# Altium schematic sheet Sheet1.SchDoc
size A3; SheetNumber: 1; SheetTotal: 1
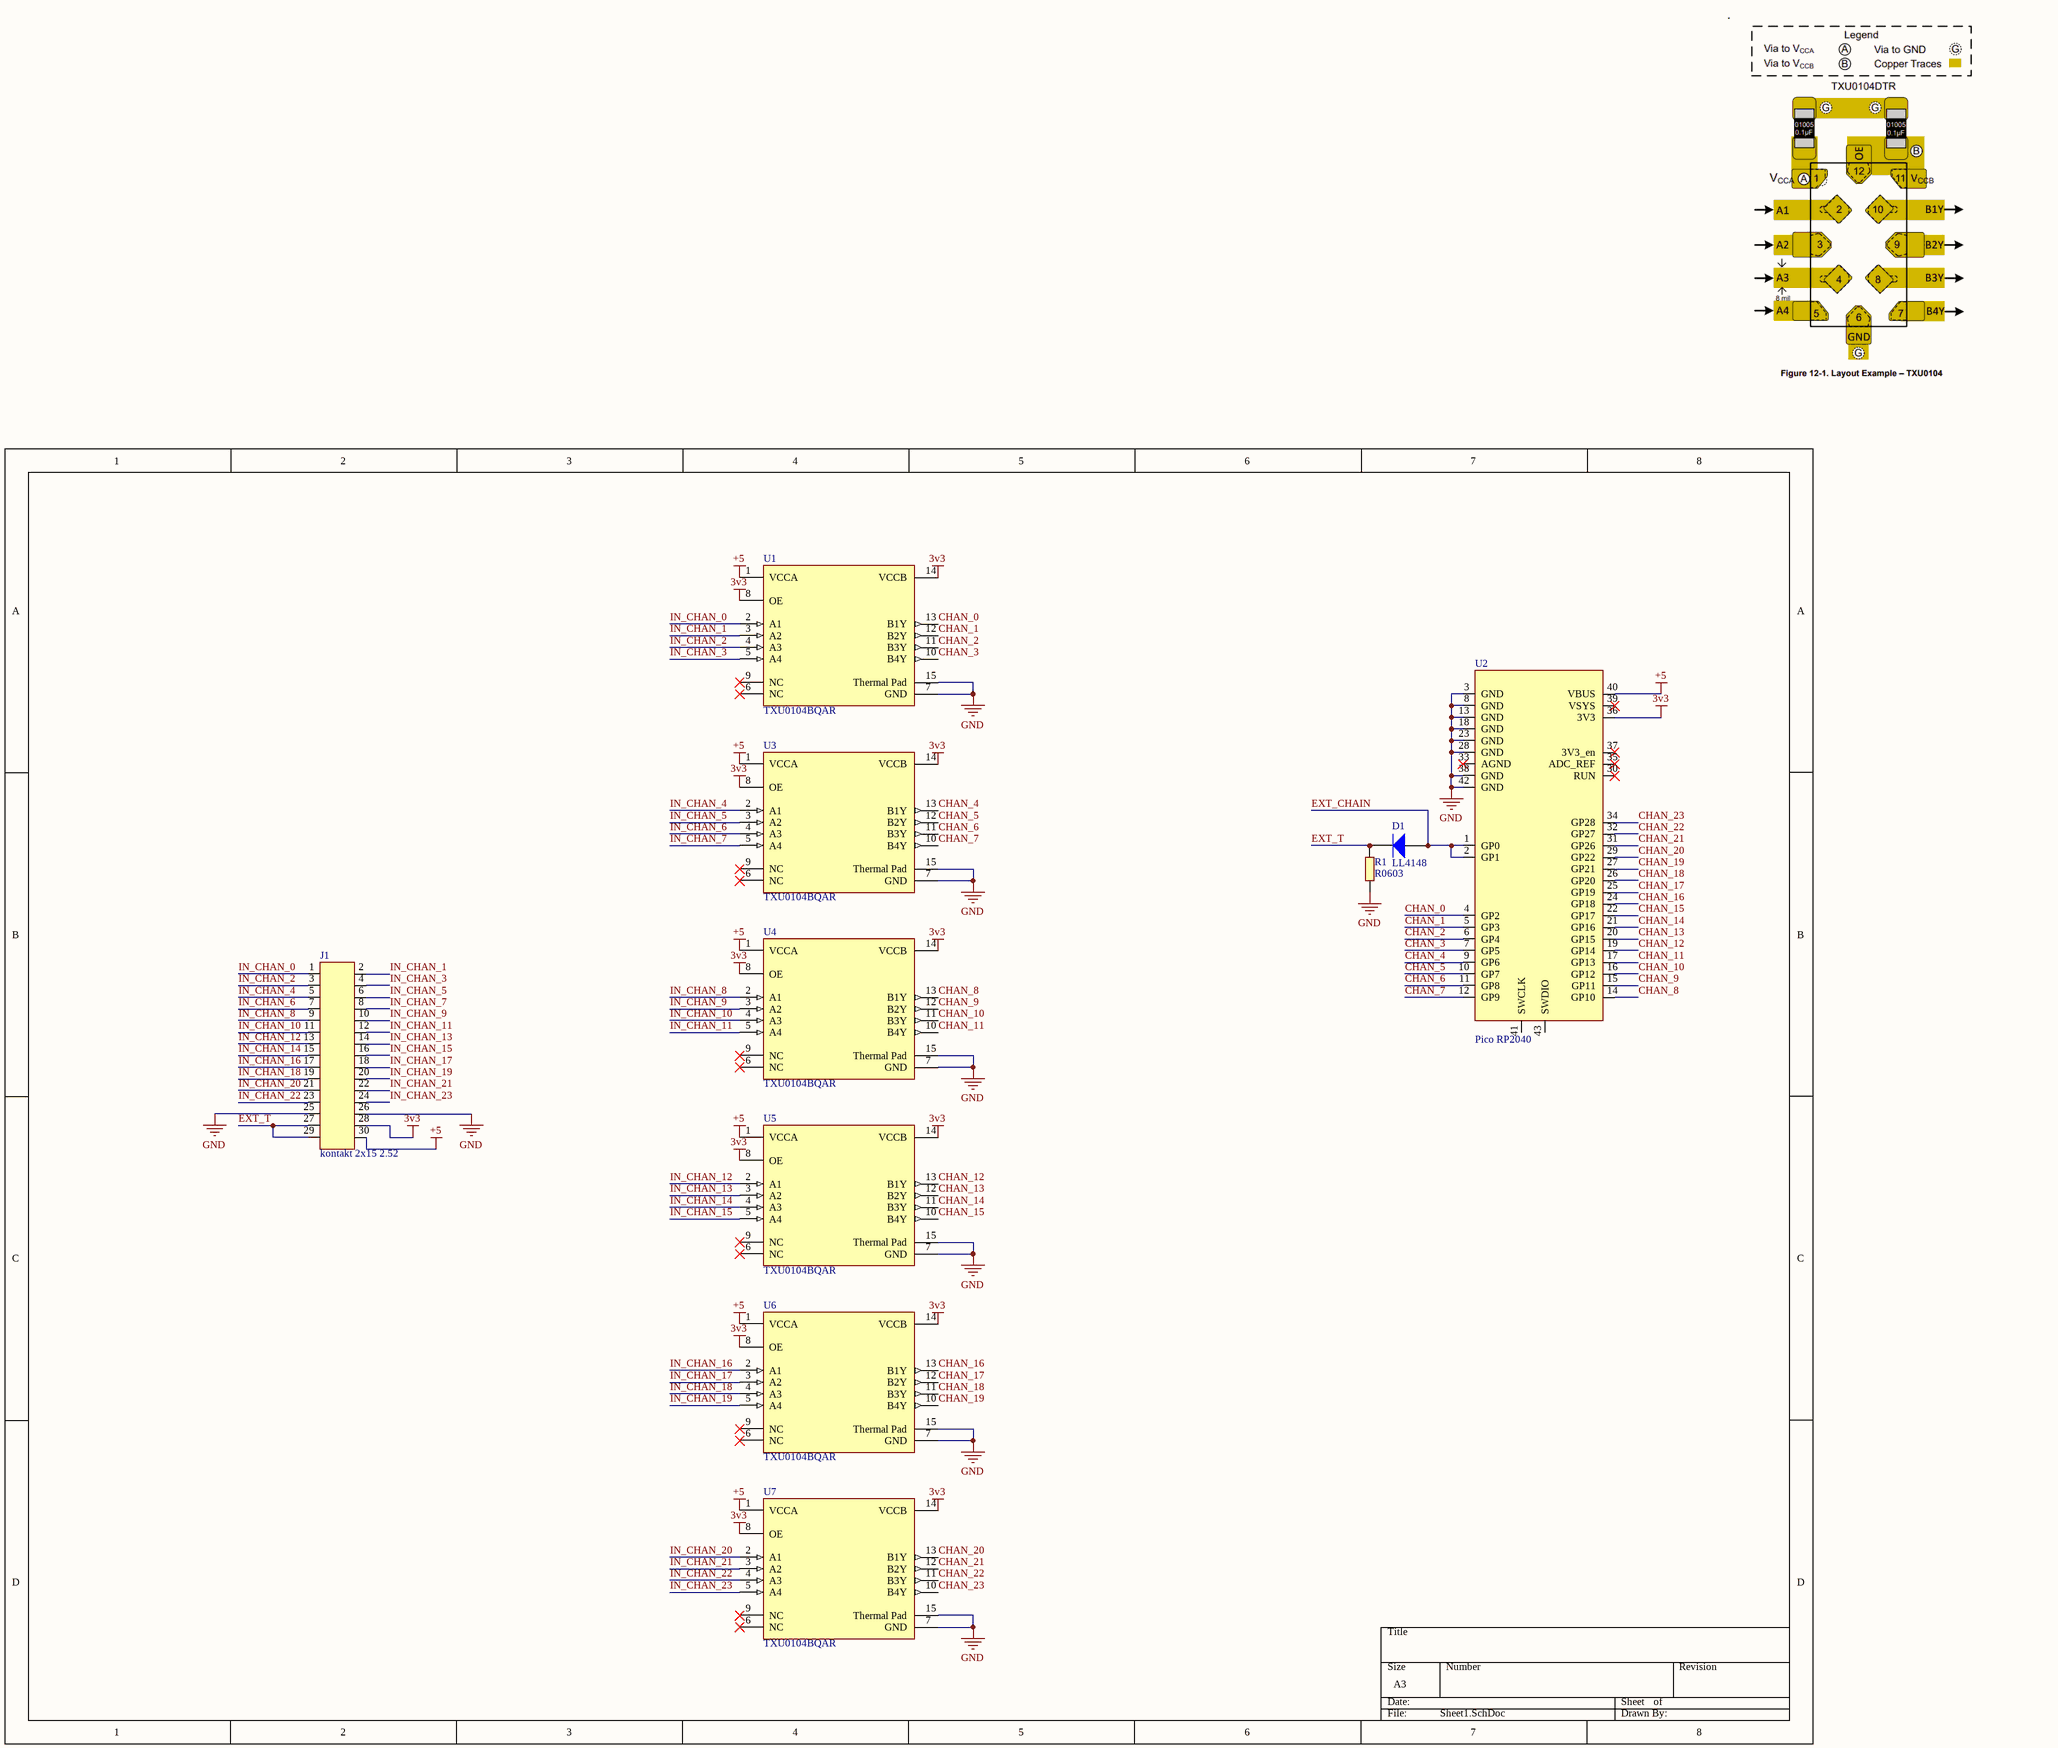
[diagram p0: Sheet1.SchDoc]

## Parts
D1  LL4148  [FAIR-SOD80-2_V]
J1  kontakt 2x15 2.52
R1  R0603  [Res 0603]
U1  TXU0104BQAR  [FP-BQA0014A-MFG]
U2  Pico RP2040  [raspberry pico solder plate]
U3  TXU0104BQAR  [FP-BQA0014A-MFG]
U4  TXU0104BQAR  [FP-BQA0014A-MFG]
U5  TXU0104BQAR  [FP-BQA0014A-MFG]
U6  TXU0104BQAR  [FP-BQA0014A-MFG]
U7  TXU0104BQAR  [FP-BQA0014A-MFG]

## Nets
3v3: J1.28 U1.8(OE) U1.14(VCCB) U2.36(3V3) U3.8(OE) U3.14(VCCB) U4.8(OE) U4.14(VCCB) U5.8(OE) U5.14(VCCB) U6.8(OE) U6.14(VCCB) U7.8(OE) U7.14(VCCB)
+5: J1.30 U1.1(VCCA) U2.40(VBUS) U3.1(VCCA) U4.1(VCCA) U5.1(VCCA) U6.1(VCCA) U7.1(VCCA)
GND: J1.25 J1.26 R1.1 U1.7(GND) U1.15(Thermal_Pad) U2.3(GND) U2.8(GND) U2.13(GND) U2.18(GND) U2.23(GND) U2.28(GND) U2.38(GND) U2.42(GND) U3.7(GND) U3.15(Thermal_Pad) U4.7(GND) U4.15(Thermal_Pad) U5.7(GND) U5.15(Thermal_Pad) U6.7(GND) U6.15(Thermal_Pad) U7.7(GND) U7.15(Thermal_Pad)
CHAN_0: U1.13(B1Y) U2.4(GP2)
CHAN_1: U1.12(B2Y) U2.5(GP3)
CHAN_2: U1.11(B3Y) U2.6(GP4)
CHAN_3: U1.10(B4Y) U2.7(GP5)
CHAN_4: U2.9(GP6) U3.13(B1Y)
CHAN_5: U2.10(GP7) U3.12(B2Y)
CHAN_6: U2.11(GP8) U3.11(B3Y)
CHAN_7: U2.12(GP9) U3.10(B4Y)
CHAN_8: U2.14(GP10) U4.13(B1Y)
CHAN_9: U2.15(GP11) U4.12(B2Y)
CHAN_10: U2.16(GP12) U4.11(B3Y)
CHAN_11: U2.17(GP13) U4.10(B4Y)
CHAN_12: U2.19(GP14) U5.13(B1Y)
CHAN_13: U2.20(GP15) U5.12(B2Y)
CHAN_14: U2.21(GP16) U5.11(B3Y)
CHAN_15: U2.22(GP17) U5.10(B4Y)
CHAN_16: U2.24(GP18) U6.13(B1Y)
CHAN_17: U2.25(GP19) U6.12(B2Y)
CHAN_18: U2.26(GP20) U6.11(B3Y)
CHAN_19: U2.27(GP21) U6.10(B4Y)
CHAN_20: U2.29(GP22) U7.13(B1Y)
CHAN_21: U2.31(GP26) U7.12(B2Y)
CHAN_22: U2.32(GP27) U7.11(B3Y)
CHAN_23: U2.34(GP28) U7.10(B4Y)
EXT_CHAIN: D1.1(A) U2.1(GP0) U2.2(GP1)
EXT_T: D1.2(K) J1.27 J1.29 R1.2
IN_CHAN_0: J1.1 U1.2(A1)
IN_CHAN_1: J1.2 U1.3(A2)
IN_CHAN_2: J1.3 U1.4(A3)
IN_CHAN_3: J1.4 U1.5(A4)
IN_CHAN_4: J1.5 U3.2(A1)
IN_CHAN_5: J1.6 U3.3(A2)
IN_CHAN_6: J1.7 U3.4(A3)
IN_CHAN_7: J1.8 U3.5(A4)
IN_CHAN_8: J1.9 U4.2(A1)
IN_CHAN_9: J1.10 U4.3(A2)
IN_CHAN_10: J1.11 U4.4(A3)
IN_CHAN_11: J1.12 U4.5(A4)
IN_CHAN_12: J1.13 U5.2(A1)
IN_CHAN_13: J1.14 U5.3(A2)
IN_CHAN_14: J1.15 U5.4(A3)
IN_CHAN_15: J1.16 U5.5(A4)
IN_CHAN_16: J1.17 U6.2(A1)
IN_CHAN_17: J1.18 U6.3(A2)
IN_CHAN_18: J1.19 U6.4(A3)
IN_CHAN_19: J1.20 U6.5(A4)
IN_CHAN_20: J1.21 U7.2(A1)
IN_CHAN_21: J1.22 U7.3(A2)
IN_CHAN_22: J1.23 U7.4(A3)
IN_CHAN_23: J1.24 U7.5(A4)

Not connected (* = marked no-connect by the designer): U1 6(NC)* 9(NC)*; U2 30(RUN)* 33(AGND)* 35(ADC_REF)* 37(3V3_en)* 39(VSYS)* 41(SWCLK) 43(SWDIO); U3 6(NC)* 9(NC)*; U4 6(NC)* 9(NC)*; U5 6(NC)* 9(NC)*; U6 6(NC)* 9(NC)*; U7 6(NC)* 9(NC)*

## Library data of the parts
D1 = CMP-2000-05115-2: Small Signal Diode, 100 V, 0.2 A, -55 to 175 degC, 2-Pin SOD80, RoHS, Tape and Reel; Manufacturer: Fairchild; Reverse Voltage-Max [Vrrm]: 100V; Average Forward Current-Max: 200mA; Forward Voltage: 1V; Reverse Recovery Time-Max: 1ns; Power Dissipation: 500mW; Datasheet URL: https://www.fairchildsemi.com/datasheets/LL/LL4148.pdf; Manufacturer URL: https://www.fairchildsemi.com/; Datasheet Version: Rev. 1.8, 01/2016
U1 U3-U7 = CMP-04899-000128-1: FOUR CHANNEL UNIDIRECTIONAL LEVE